# EAGLE design MegaSound9x HaGeHa SIP v1 (EAGLE 6.4)
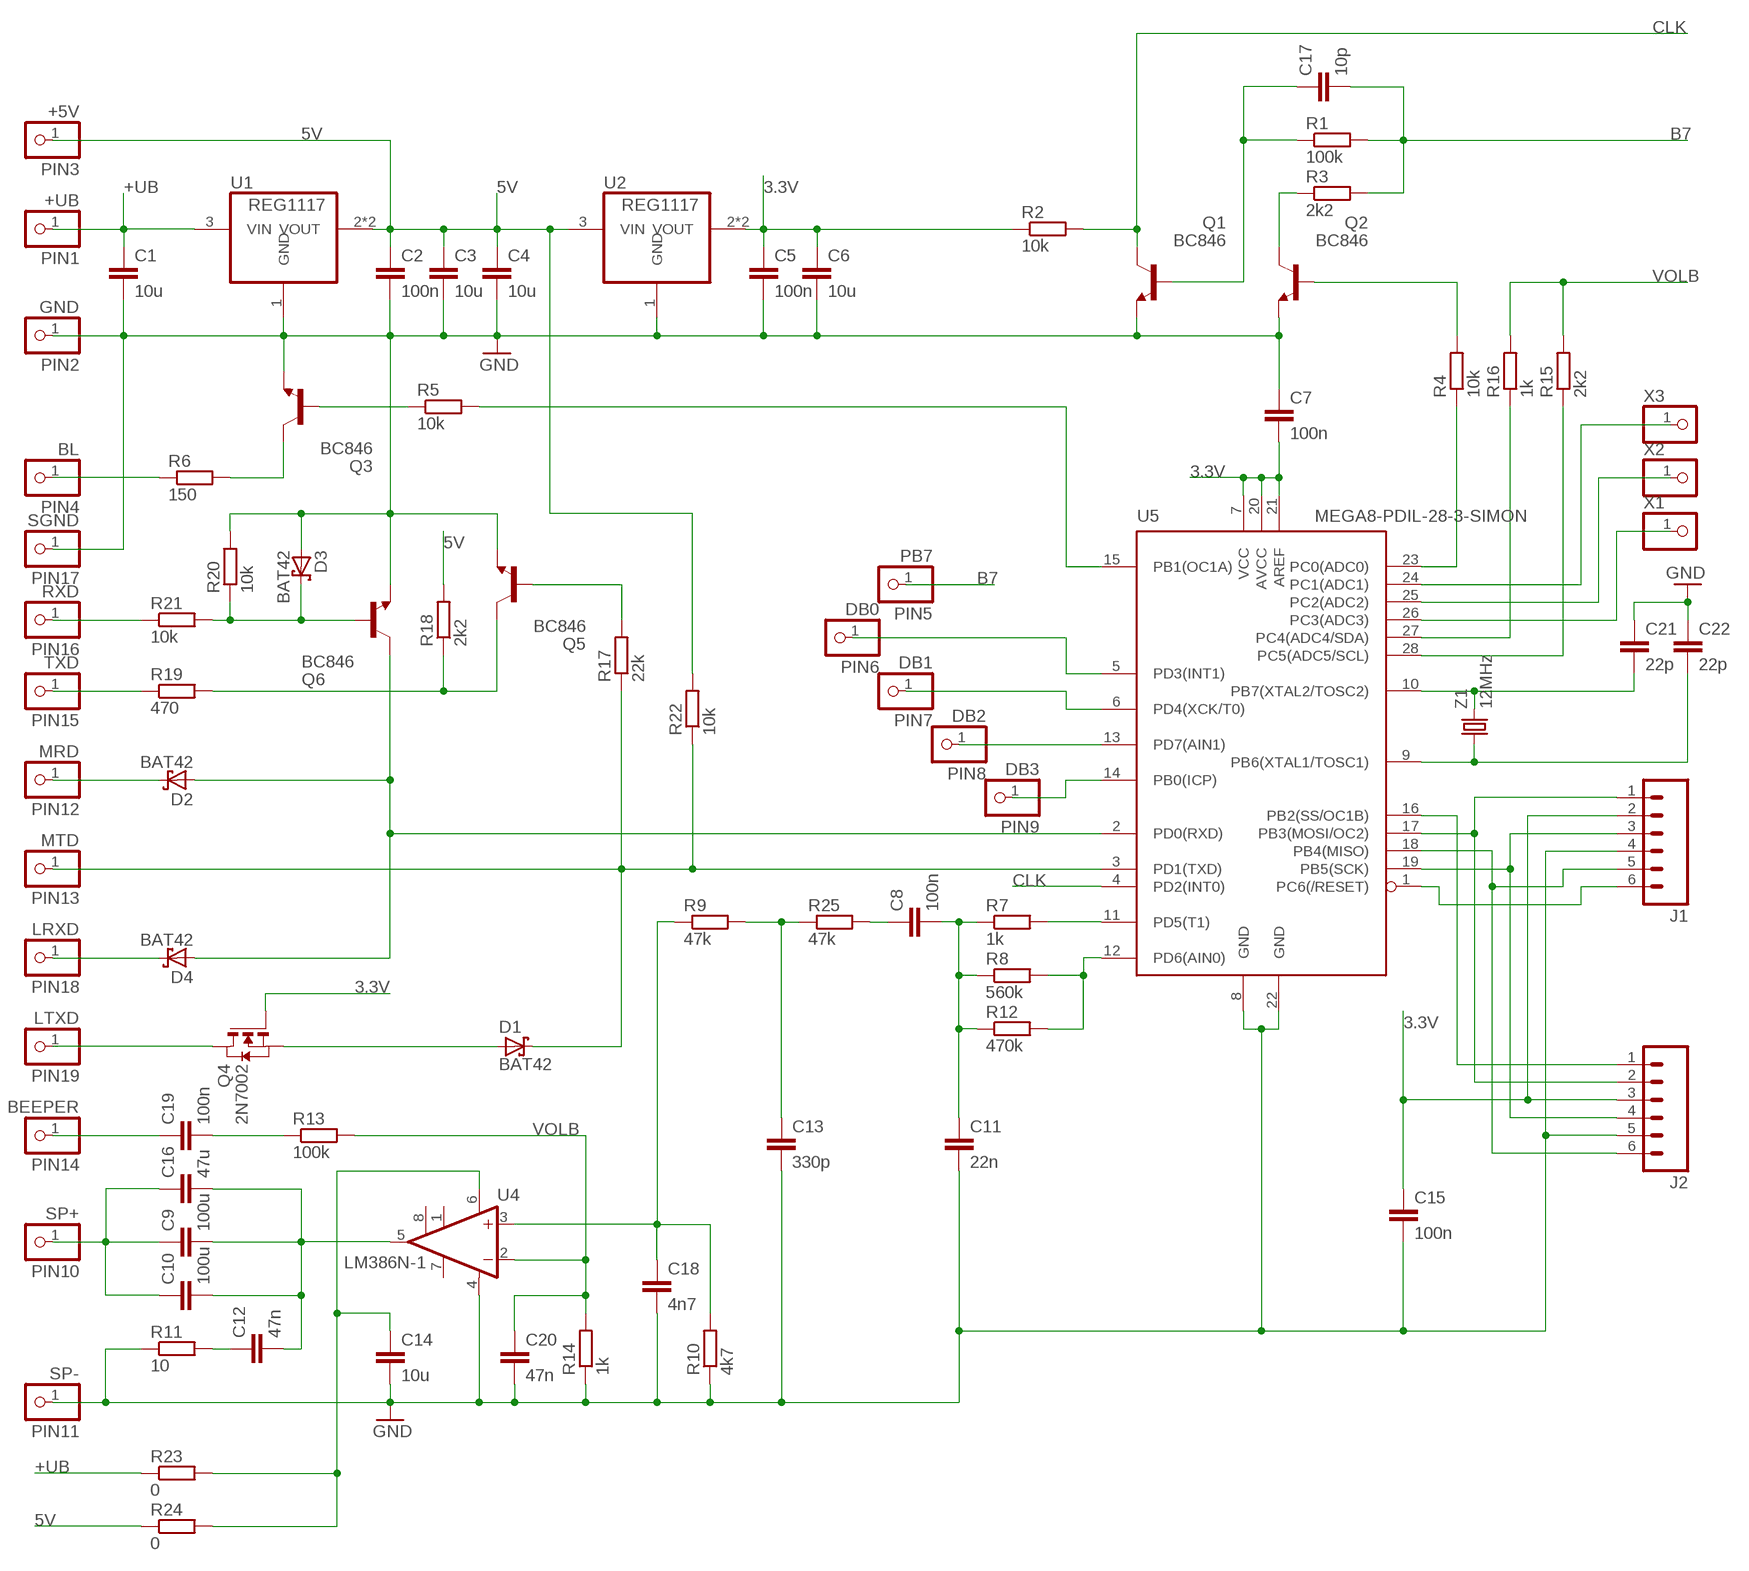
[diagram p0: schematic, sheet 1]

## Parts
+5V  PIN3  PINHD-1X1  [1X01]
+UB  PIN1  PINHD-1X1  [1X01]
BEEPER  PIN14  PINHD-1X1  [1X01]
BL  PIN4  PINHD-1X1  [1X01]
C1  10u  C-EUC1206  [C1206]
C2  100n  C-EUC1206  [C1206]
C3  10u  C-EUC1206  [C1206]
C4  10u  C-EUC1206  [C1206]
C5  100n  C-EUC1206  [C1206]
C6  10u  C-EUC1206  [C1206]
C7  100n  C-EUC1206  [C1206]
C8  100n  C-EUC1206  [C1206]
C9  100u  C-EUC1206  [C1206]
C10  100u  C-EUC1206  [C1206]
C11  22n  C-EUC1206  [C1206]
C12  47n  C-EUC1206  [C1206]
C13  330p  C-EUC1206  [C1206]
C14  10u  C-EUC1206  [C1206]
C15  100n  C-EUC1206  [C1206]
C16  47u  C-EUC1206  [C1206]
C17  10p  C-EUC1206  [C1206]
C18  4n7  C-EUC1206  [C1206]
C19  100n  C-EUC1206  [C1206]
C20  47n  C-EUC1206  [C1206]
C21  22p  C-EUC1206  [C1206]
C22  22p  C-EUC1206  [C1206]
D1  BAT42  [SOD123]
D2  BAT42  [SOD123]
D3  BAT42  [SOD123]
D4  BAT42  [SOD123]
DB0  PIN6  PINHD-1X1  [1X01]
DB1  PIN7  PINHD-1X1  [1X01]
DB2  PIN8  PINHD-1X1  [1X01]
DB3  PIN9  PINHD-1X1  [1X01]
GND  PIN2  PINHD-1X1  [1X01]
J1  M06SIP  [1X06]
J2  M06SIP  [1X06]
LRXD  PIN18  PINHD-1X1  [1X01]
LTXD  PIN19  PINHD-1X1  [1X01]
MRD  PIN12  PINHD-1X1  [1X01]
MTD  PIN13  PINHD-1X1  [1X01]
PB7  PIN5  PINHD-1X1  [1X01]
Q1  BC846  [SOT23]
Q2  BC846  [SOT23]
Q3  BC846  [SOT23]
Q4  2N7002  NMOSSOT23  [SOT-23]
Q5  BC846  [SOT23]
Q6  BC846  [SOT23]
R1  100k  R-EU_R1206  [R1206]
R2  10k  R-EU_R1206  [R1206]
R3  2k2  R-EU_R1206  [R1206]
R4  10k  R-EU_R1206  [R1206]
R5  10k  R-EU_R1206  [R1206]
R6  150  R-EU_R1206  [R1206]
R7  1k  R-EU_R1206  [R1206]
R8  560k  R-EU_R1206  [R1206]
R9  47k  R-EU_R1206  [R1206]
R10  4k7  R-EU_R1206  [R1206]
R11  10  R-EU_R1206  [R1206]
R12  470k  R-EU_R1206  [R1206]
R13  100k  R-EU_R1206  [R1206]
R14  1k  R-EU_R1206  [R1206]
R15  2k2  R-EU_R1206  [R1206]
R16  1k  R-EU_R1206  [R1206]
R17  22k  R-EU_R1206  [R1206]
R18  2k2  R-EU_R1206  [R1206]
R19  470  R-EU_R1206  [R1206]
R20  10k  R-EU_R1206  [R1206]
R21  10k  R-EU_R1206  [R1206]
R22  10k  R-EU_R1206  [R1206]
R23  0  R-EU_R1206  [R1206]
R24  0  R-EU_R1206  [R1206]
R25  47k  R-EU_R1206  [R1206]
RXD  PIN16  PINHD-1X1  [1X01]
SGND  PIN17  PINHD-1X1  [1X01]
SP+  PIN10  PINHD-1X1  [1X01]
SP-  PIN11  PINHD-1X1  [1X01]
TXD  PIN15  PINHD-1X1  [1X01]
U1  REG1117  [SOT223]
U2  REG1117  [SOT223]
U4  LM386N-1  [DIL08]
U5  MEGA8-PDIL-28-3-SIMON  [DIL28-3-SIMON]
X1  PINHD-1X1  [1X01]
X2  PINHD-1X1  [1X01]
X3  PINHD-1X1  [1X01]
Z1  12MHz  CRYSTALHC49US  [HC49US]

## Nets
3.3V: C5.1 C6.1 C7.2 C15.1 J1.2 J2.3 Q4.3(G) R2.1 U2.2(VOUT) U2.4(VOUT) U5.7(VCC) U5.20(AVCC) U5.21(AREF)
5V: +5V.1 C2.1 C3.1 C4.1 R18.2 R22.2 R24.1 U1.2(VOUT) U1.4(VOUT) U2.3(VIN)
+UB: +UB.1 C1.1 R23.1 U1.3(VIN)
B7: C17.2 PB7.1 R1.2 R3.2
CLK: Q1.3(C) R2.2 U5.4(PD2(INT0))
D0: DB0.1 U5.5(PD3(INT1))
GND: C1.2 C2.2 C3.2 C4.2 C5.2 C6.2 C7.1 C11.2 C13.2 C14.2 C15.2 C18.2 C20.2 C21.1 C22.1 D3.A GND.1 J1.4 J2.5 Q1.2(E) Q2.2(E) Q3.2(E) Q5.2(E) Q6.2(E) R10.1 R11.1 R14.1 R20.2 SGND.1 SP-.1 U1.1(GND) U2.1(GND) U4.4(GND) U5.8(GND) U5.22(GND)
N$1: C18.1 R9.1 R10.2 U4.3(+IN)
N$2: C12.1 R11.2
N$3: C14.1 R23.2 R24.2 U4.6(VS)
N$4: C9.2 C10.2 C12.2 C16.2 U4.5(OUT)
N$5: C9.1 C10.1 C16.1 SP+.1
N$6: BEEPER.1 C19.1
N$7: C19.2 R13.1
N$8: LTXD.1 Q4.1(D)
N$9: D1.A Q4.2(S)
N$10: D4.C LRXD.1
N$11: D1.C MTD.1 R17.1 R22.1 U5.3(PD1(TXD))
N$12: D2.C MRD.1
N$13: R19.1 TXD.1
N$14: R21.1 RXD.1
N$15: BL.1 R6.1
N$16: Q5.3(C) R18.1 R19.2
N$20: Q3.3(C) R6.2
N$21: Q3.1(B) R5.1
N$22: Q2.1(B) R4.2
N$23: D3.C Q6.1(B) R20.1 R21.2
N$24: Q5.1(B) R17.2
N$25: D2.A D4.A Q6.3(C) U5.2(PD0(RXD))
N$28: R7.2 U5.11(PD5(T1))
N$29: C13.1 R9.2 R25.1
N$30: C8.1 R25.2
N$31: C8.2 C11.1 R7.1 R8.1 R12.1
N$32: R8.2 R12.2 U5.12(PD6(AIN0))
N$33: DB3.1 U5.14(PB0(ICP))
N$34: DB2.1 U5.13(PD7(AIN1))
N$35: DB1.1 U5.6(PD4(XCK/T0))
N$36: Q2.3(C) R3.1
N$37: R5.2 U5.15(PB1(OC1A))
N$38: C17.1 Q1.1(B) R1.1
N$39: R4.1 U5.23(PC0(ADC0))
N$40: R16.1 U5.27(PC4(ADC4/SDA))
N$41: R15.1 U5.28(PC5(ADC5/SCL))
N$42: C21.2 U5.10(PB7(XTAL2/TOSC2)) Z1.2
N$43: C22.2 U5.9(PB6(XTAL1/TOSC1)) Z1.1
N$44: U5.24(PC1(ADC1)) X3.1
N$45: U5.25(PC2(ADC2)) X2.1
N$46: U5.26(PC3(ADC3)) X1.1
N$47: J1.3 J2.4 U5.19(PB5(SCK))
N$48: J1.5 J2.6 U5.18(PB4(MISO))
N$49: J1.6 U5.1(PC6(/RESET))
N$50: J1.1 J2.2 U5.17(PB3(MOSI/OC2))
N$51: J2.1 U5.16(PB2(SS/OC1B))
VOLB: C20.1 R13.2 R14.2 R15.2 R16.2 U4.2(-IN)
Unconnected: U4.1(GAIN) U4.7(BYPASS) U4.8(GAIN)

## Library data of the parts
+5V +UB BEEPER BL DB0 DB1-DB3 GND LRXD LTXD MRD MTD PB7 RXD SGND SP+ SP- TXD X1-X3 = pinhead:PINHD-1X1: PIN HEADER
C1-C22 = rcl:C-EU: CAPACITOR, European symbol
D1-D4 = jdc:BAT42: Schottky Diodes
J1 J2 = SparkFun-Connectors:M06: Header 6 Standard 6-pin 0.1" header. Use with straight break away headers (SKU : PRT-00116), right angle break away headers (PRT-00553), swiss pins (PRT-00743), machine pins (PRT-00117), and female headers (PRT-00115). Molex polarized connector foot print use with SKU : PRT-08094 with associated crimp pins and housings. NOTES ON THE VARIANTS LOCK and LOCK_LONGPADS... This footprint was designed to help hold the alignment of a through-hole component (i.e. 6-pin header) while soldering it into place. You may notice that each hole has been shifted either up or down by 0.005 of an inch from it's more standard position (which is a perfectly straight line). This slight alteration caused the pins (the squares in the middle) to touch the edges of the holes. Because they are alternating, it causes a "brace" to hold the component in place. 0.005 has proven to be the perfect amount of "off-center" position when using our standard breakaway headers. Although looks a little odd when you look at the bare footprint, once you have a header in there, the alteration is very hard to notice. Also, if you push a header all the way into place, it is covered up entirely on the bottom side. This idea of altering the position of holes to aid alignment will be further integrated into the Sparkfun Library for other footprints. It can help hold any component with 3 or more connection pins.
Q1-Q3 Q5 Q6 = transistor:BC846: NPN TRANSISTOR
Q4 = zetex:NMOSSOT23: MOS FET; OC_FARNELL: unknown; OC_NEWARK: unknown
R1-R25 = rcl:R-EU_: RESISTOR, European symbol
U1 U2 = jdc:REG1117: 800mA and 1A Low Dropout (LDO) Positive Regulator 1.8V, 2.5V, 2.85V, 3.3V, 5V, and Adj; MPN: REG1117; OC_FARNELL: 1097566; OC_NEWARK: 14P6981
U4 = linear:LM386?-*: Low Voltage Audio Power Amplifier Source: http://cache.national.com/ds/LM/LM386.pdf
U5 = jdc:MEGA8-P: MICROCONTROLLER 8 Kbytes FLASH, 1 kbytes SRAM, 512 bytes EEPROM, USART, 4-channel 10 bit ADC, 2-channel 8 bit ADC Pin compatible with Atmega48, ATMega88, ATMega168 Source: avr.lbr
Z1 = SparkFun-FreqCtrl:CRYSTAL: Various standard crystals. Proven footprints. Spark Fun Electronics SKU : COM-00534

## Board
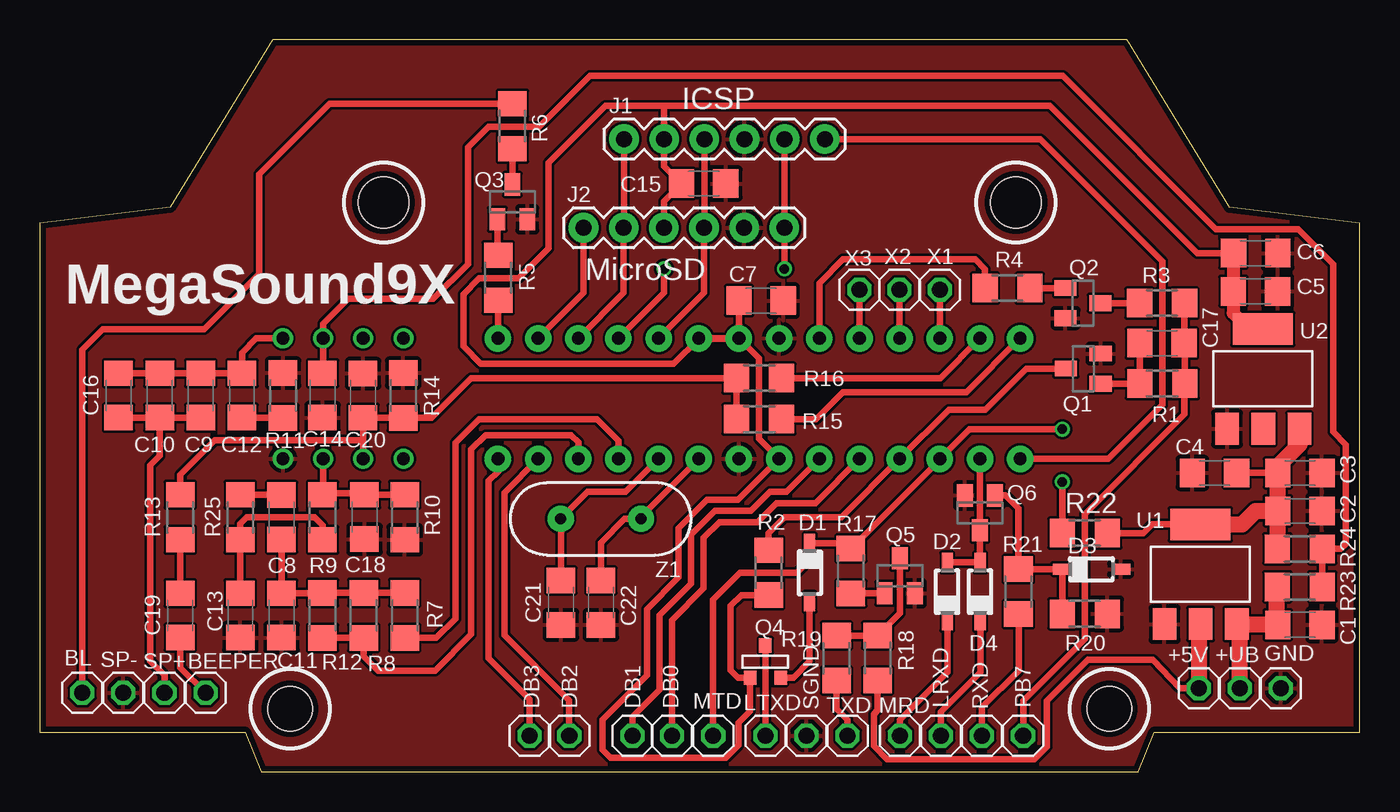
[diagram p1: board, top side]
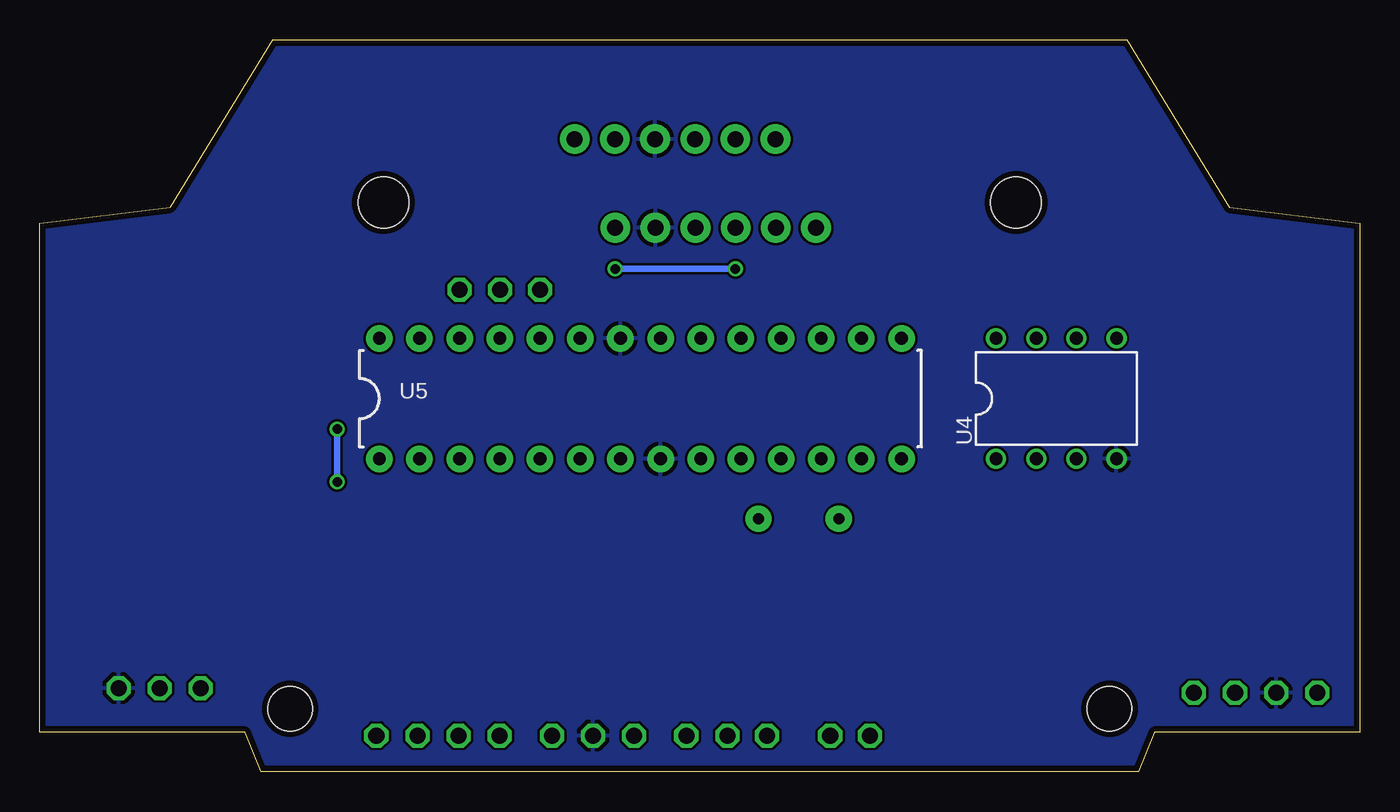
[diagram p2: board, bottom side, seen from below]

Size 83.5 x 46.3 mm. Coordinates in mm from the lower left corner, seen from the top.
Outline: 0,2.5 13,2.5 14,0 69.5,0 70.5,2.5 83.5,2.5 83.5,34.7 75.25,35.7 68.75,46.3 14.75,46.3 8.25,35.7 0,34.7 0,2.5
Copper layers (1*16): Top 0.0356mm / dielectric 1.5011mm / Bottom 0.0356mm
Design rules "LaenPCBOrder *": minimum track width 6mil, minimum drill 13mil, track to track 6mil, track to pad 6mil, pad to pad 6mil, via to via 6mil, smd to smd 6mil, copper to edge 15mil, drill to drill 6mil, minimum pad ring 7mil, minimum via ring 7mil, stop-mask expansion 4mil, vias tented up to drill 24mil, thermal gap 10mil
Holes 2.8 mm at 15.84,4 67.65,4
Holes 3.2 mm at 21.75,36 61.75,36

### Footprints (pad centres in the part's own frame; a part is rotated, then mirrored left to right if it is on the bottom)
1X01 = drill 1.016 octagon: 1 0,0
C1206 = smd 1.6 x 1.8: 1 -1.4,0; 2 1.4,0
SOD123 = smd 1.2 x 0.7: A 1.85,0; C -1.85,0
1X06 = drill 1.016 pad 1.88: 1 0,0; 2 2.54,0; 3 5.08,0; 4 7.62,0; 5 10.16,0; 6 12.7,0
SOT23 = smd 1 x 1.4: 1 -0.95,-1.1; 2 0.95,-1.1; 3 0,1.1
SOT-23 = smd 0.787 x 0.889: 1 0.025,-1.016; 2 -0.94,1.016; 3 0.991,1.016
R1206 = smd 1.6 x 1.803: 1 -1.422,0; 2 1.422,0
SOT223 = smd 1.499 x 2.007: 1 -2.261,-3.15; 2 0.025,-3.15; 3 2.311,-3.15 | smd 3.81 x 2.007: 4 0,3.15
DIL08 = drill 0.813 pad 1.27: 1 -3.81,-3.81; 2 -1.27,-3.81; 3 1.27,-3.81; 4 3.81,-3.81; 5 3.81,3.81; 6 1.27,3.81; 7 -1.27,3.81; 8 -3.81,3.81
DIL28-3-SIMON = drill 0.813 pad 1.676: 1 -16.51,-3.81; 2 -13.97,-3.81; 3 -11.43,-3.81; 4 -8.89,-3.81; 5 -6.35,-3.81; 6 -3.81,-3.81; 7 -1.27,-3.81; 8 1.27,-3.81; 9 3.81,-3.81; 10 6.35,-3.81; 11 8.89,-3.81; 12 11.43,-3.81; 13 13.97,-3.81; 14 16.51,-3.81; 15 16.51,3.81; 16 13.97,3.81; 17 11.43,3.81; 18 8.89,3.81; 19 6.35,3.81; 20 3.81,3.81; 21 1.27,3.81; 22 -1.27,3.81; 23 -3.81,3.81; 24 -6.35,3.81; 25 -8.89,3.81; 26 -11.43,3.81; 27 -13.97,3.81; 28 -16.51,3.81
HC49US = drill 0.7 pad 1.651: 1 -2.54,0; 2 2.54,0

### Placement (x,y rotation side)
+5V  73.3,5.3 0 top
+UB  75.9,5.3 0 top
BEEPER  10.5,5 0 top
BL  2.7,5 0 top
C1  79.7,9.3 0 top
C2  79.7,16.5 0 top
C3  79.7,18.9 0 top
C4  74.3,18.9 180 top
C5  76.89,30.38 0 top
C6  76.9,32.8 0 top
C7  45.63,29.79 180 top
C8  15.3,16.1 270 top
C9  10.2,23.8 90 top
C10  7.6,23.8 90 top
C11  15.3,9.9 270 top
C12  12.8,23.8 90 top
C13  12.7,9.9 270 top
C14  17.9,23.8 270 top
C15  42,37.2 0 top
C16  5,23.8 90 top
C17  70.98,27.11 0 top
C18  20.55,16.12 270 top
C19  8.9,9.9 90 top
C20  20.46,23.79 90 top
C21  32.97,10.7 90 top
C22  35.5,10.7 90 top
D1  48.7,12.6 270 top
D2  57.4,11.4 90 top
D3  66.52,12.82 0 top
D4  59.48,11.4 90 top
DB0  40,2.3 0 top
DB1  37.5,2.3 0 top
DB2  33.5,2.3 0 top
DB3  31,2.3 0 top
GND  78.5,5.3 0 top
J1  36.96,40.01 0 top
J2  34.4,34.4 0 top
LRXD  57,2.3 0 top
LTXD  45.9,2.3 0 top
MRD  54.4,2.3 0 top
MTD  42.6,2.3 0 top
PB7  62.2,2.3 0 top
Q1  66,25.5 90 top
Q2  65.98,29.64 270 top
Q3  29.9,36.04 0 top
Q4  45.92,6.98 180 top
Q5  54.4,12.4 0 top
Q6  59.47,16.38 180 top
R1  71,24.55 0 top
R2  46.1,12.6 90 top
R3  70.98,29.64 0 top
R4  61.21,30.59 0 top
R5  29,31.24 270 top
R6  29.9,40.82 270 top
R7  23.1,9.9 270 top
R8  20.5,9.9 270 top
R9  17.9,16.1 270 top
R10  23.1,16.1 90 top
R11  15.4,23.8 270 top
R12  17.9,9.9 270 top
R13  8.9,16.1 90 top
R14  23,23.8 270 top
R15  45.5,22.3 180 top
R16  45.5,24.9 180 top
R17  51.3,12.7 270 top
R18  53,7.2 270 top
R19  50.4,7.2 90 top
R20  66.1,10 0 top
R21  61.9,11.4 90 top
R22  66.1,15.1 0 top
R23  79.7,11.7 0 top
R24  79.7,14.1 0 top
R25  12.7,16.1 90 top
RXD  59.6,2.3 0 top
SGND  48.5,2.3 0 top
SP+  7.9,5 0 top
SP-  5.3,5 0 top
TXD  51.1,2.3 0 top
U1  73.4,12.5 0 top
U2  77.36,24.85 0 top
U4  19.2,23.6 0 bottom
U5  45.5,23.6 0 bottom
X1  56.93,30.48 0 top
X2  54.37,30.48 0 top
X3  51.85,30.48 0 top
Z1  35.5,16 180 top

### Tracks (layer width: path | path; a pad name or v marks a point on that pad's centre or on a via)
3.3V
  Top 0.254: 77.39,27.97 U2.4
  Top 0.406: J2.3 39.48,36.08 C15.1 39.5,38.3 J1.2 39.5,42 39.6,42.1 | U5.20 U5.21 | U5.21 C7.2 U5.21 U5.20 40.1,25.8 27.9,25.8 26.8,26.9 26.8,30.2 27.8,31.2 30.3,31.2 32.2,33.1 32.2,38.5 35.8,42.1 39.6,42.1 | U5.21 45.5,26.14 45.5,21.06 U5.7 44.18,17.2 42.2,17.2 40.4,15.4 40.4,12.3 38.4,10.3 38.4,6.1 35.6,3.3 35.6,1.4 36.1,0.9 43.4,0.9 44.2,1.7 44.2,3.12 44.93,3.85 Q4.3 44.16,5.97 43.7,6.43 43.7,10.5 44.38,11.18 R2.1 | 39.6,42.1 63.9,42.1 73.2,32.8 C6.1
  Top 0.813: C6.1 C5.1 75.49,29.01 76.5,28 U2.4 | U2.4
5V
  Top 0.254: 73.4,9.38 U1.2
  Top 0.406: R18.2 53,3.9 52.75,3.65 52.75,1.65 53.6,0.8 62.9,0.8 63.7,1.6 63.7,4.5 66.3,7.1 70.4,7.1 72.1,5.3 +5V.1 | 78.3,14.12 R24.1 | C3.1 C4.1 | R22.2 69.8,15.1 70.36,15.66 U1.4
  Top 1.016: U1.2 73.3,9.22 +5V.1 | U2.3 79.68,20.71 78.3,19.33 C3.1 C2.1 | 78.3,14.12 C2.1 | U1.4 76.05,15.65 76.9,16.5 C2.1
+UB
  Top 0.406: 78.28,9.32 C1.1
  Top 1.016: +UB.1 75.9,9.16 U1.3 78.25,9.35 | 78.25,9.35 C1.1 | 78.25,9.35 78.25,11.67 R23.1
B7
  Top 0.406: R3.2 72.38,29.62 C17.2 72.42,27.07 R1.2 72.4,24.53 72.4,22.6 66.1,16.3 66.1,8.4 62.2,4.5 PB7.1
CLK
  Top 0.406: R2.2 46.1,15.1 47.1,16.1 50.7,16.1 U5.4 57.5,22.9 59.8,22.9 62.4,25.5 Q1.3
D0
  Top 0.406: DB0.1 40,9.6 42,11.6 42,14.8 43,15.8 45.4,15.8 46.6,17 49.06,17 U5.5
GND
  pour Top: -1,-1 84.6,-1 84.6,47.2 -1,47.2
  pour Bottom: -2,-2 85.6,-2 85.6,48.2 -2,48.2
N$1
  Top 0.406: U4.3 17.93,17.63 | 17.93,17.63 R9.1 | 17.93,17.63 20.44,17.63 C18.1 R10.2
N$2
  Top 0.406: C12.1 15.38,22.4 R11.2
N$3
  Top 0.406: C14.1 17.93,25.23 U4.6 17.93,28.33 19.5,29.9 24.9,29.9 27.1,32.1 27.1,39.5 28.4,40.8 31.6,40.8 34.8,44 64.7,44 74.4,34.3 79.6,34.3 81.8,32.1 81.8,21.5 82.6,20.7 82.6,14.4 82.3,14.1 R24.2 R23.2
N$4
  Top 0.406: U4.5 13.71,27.41 12.8,26.5 C12.2 C9.2 C10.2 C16.2
N$5
  Top 0.406: C16.1 C10.1 | C10.1 C9.1 | C10.1 7.6,20 7,19.4 7,7 7.9,6.1 SP+.1
N$6
  Top 0.406: C19.1 8.9,6.6 BEEPER.1
N$7
  Top 0.406: R13.1 C19.2
N$8
  Top 0.406: LTXD.1 Q4.1
N$9
  Top 0.406: Q4.2 47.66,5.96 48.7,7 D1.A
N$10
  Top 0.406: LRXD.1 57,3.8 59.5,6.3 59.5,9.53 D4.C
N$11  (via drill 0.6)
  Top 0.406: MTD.1 42.6,10.9 44.3,12.6 47.9,12.6 48.7,13.4 D1.C 50.97,14.45 R17.1 56.93,19.75 U5.3 58.81,21.67 v64.68,21.67 | v64.68,18.34 R22.1
  Bottom 0.406: v64.68,21.67 v64.68,18.34
N$12
  Top 0.406: MRD.1 54.4,3.3 57.4,6.3 D2.C
N$13
  Top 0.406: R19.1 50.4,4 51.1,3.3 TXD.1
N$14
  Top 0.406: RXD.1 59.6,4.08 61.92,6.4 61.92,9.96 R21.1
N$15
  Top 0.406: R6.1 18.34,42.24 13.9,37.8 13.9,31.5 10.4,28 4,28 2.7,26.7 BL.1
N$16
  Top 0.406: Q5.3 54.4,10.02 R18.1 R19.2
N$20
  Top 0.406: Q3.3 R6.2
N$21
  Top 0.406: R5.1 28.95,32.66 Q3.1
N$22
  Top 0.406: R4.2 Q2.1
N$23
  Top 0.406: Q6.1 61.09,17.48 61.9,16.67 R21.2 D3.C R20.1
N$24
  Top 0.406: Q5.1 51.32,11.3 R17.2
N$25
  Top 0.406: U5.2 Q6.3 D4.A D2.A
N$28
  Top 0.406: R7.2 25.08,8.48 26.3,9.7 26.3,20.8 27.8,22.3 35.26,22.3 36.61,20.95 U5.11
N$29
  Top 0.406: R9.2 17.9,15.6 17.4,16.1 13.1,16.1 12.7,15.7 R25.1 C13.1
N$30
  Top 0.406: R25.2 15.28,17.52 C8.1
N$31
  Top 0.406: C8.2 C11.1 17.88,11.3 R12.1 R8.1 R7.1
N$32
  Top 0.406: U5.12 34.07,20.83 33.6,21.3 28.2,21.3 27.3,20.4 27.3,8.7 25,6.4 21.4,6.4 20.5,7.3 R8.2 R12.2
N$33
  Top 0.406: U5.14 28.99,18.99 28.4,18.4 28.4,7.2 31,4.6 DB3.1
N$34
  Top 0.406: U5.13 29.4,17.66 29.4,8.65 33.5,4.55 DB2.1
N$35
  Top 0.406: DB1.1 37.5,3.5 39.2,5.2 39.2,9.9 41.2,11.9 41.2,15 42.7,16.5 45,16.5 46.2,17.7 47.22,17.7 U5.6
N$36
  Top 0.406: Q2.3 R3.1
N$37
  Top 0.406: R5.2 U5.15
N$38
  Top 0.406: Q1.1 R1.1 C17.1
N$39
  Top 0.406: U5.23 49.31,30.91 50.8,32.4 59.17,32.4 59.79,31.78 59.79,30.61 R4.1
N$40
  Top 0.406: R16.1 56.96,24.9 U5.27
N$41
  Top 0.406: R15.1 49.1,22.3 50.8,24 58.6,24 U5.28
N$42
  Top 0.406: C21.2 Z1.2 34.66,17.7 37.06,17.7 U5.10
N$43
  Top 0.406: C22.2 35.5,14.5 37,16 Z1.1 38.04,16.14 U5.9
N$44
  Top 0.406: X3.1 U5.24
N$45
  Top 0.406: X2.1 54.37,27.43 U5.25
N$46
  Top 0.406: X1.1 U5.26
N$47
  Top 0.406: J1.3 42.04,34.42 J2.4 42.02,30.28 U5.19
N$48  (via drill 0.6)
  Top 0.406: J1.5 47.12,34.42 J2.6 v47.1,31.81 | U5.18 39.5,30.3 v39.5,31.8
  Bottom 0.406: v39.5,31.8 v47.1,31.81
N$49
  Top 0.406: U5.1 67.59,19.79 71,23.2 71,32.3 63.29,40.01 J1.6
N$50
  Top 0.406: J1.1 36.96,34.42 J2.2 36.94,30.28 U5.17
N$51
  Top 0.406: J2.1 34.4,30.28 U5.16
VOLB
  Top 0.406: 20.46,20.96 C20.1 22.99,22.39 R14.2 24.78,22.38 27.3,24.9 R16.2 R15.2 | 20.46,20.96 U4.2 | R13.2 8.9,18.8 11.06,20.96 20.46,20.96

### Text on the board
tNames: ICSP | MicroSD | MegaSound9X